# Altium schematic sheet P06.USB.SchDoc
size A4
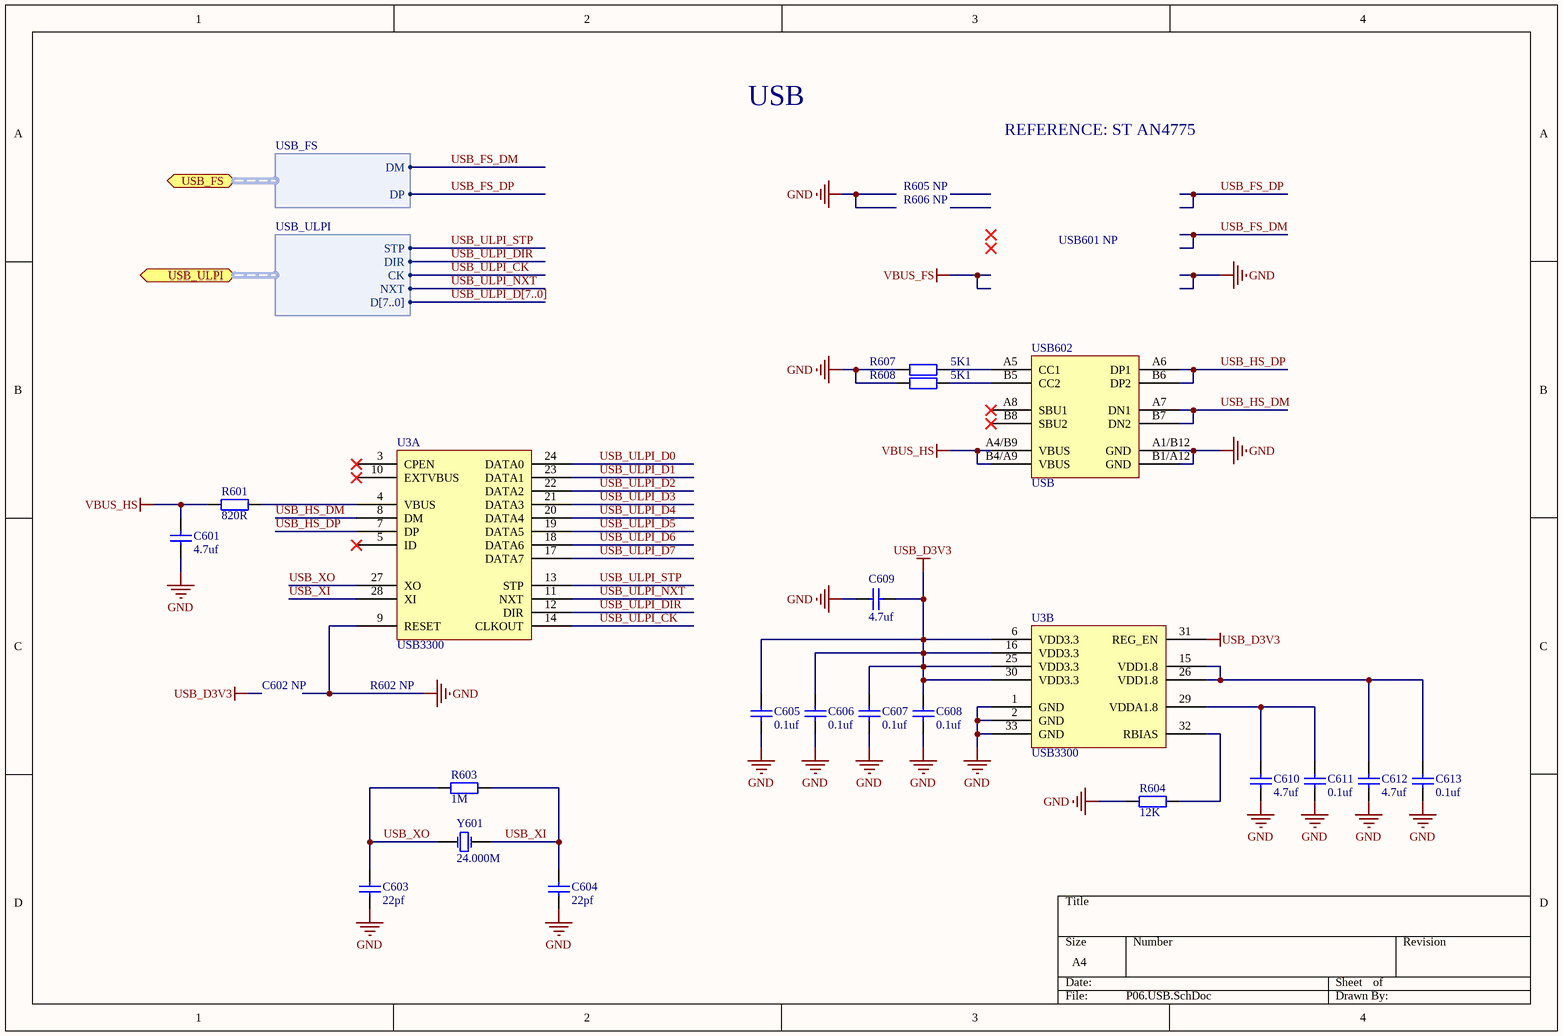
[diagram p0: P06.USB.SchDoc]

## Parts
C601  value 4.7uf  [C0603]  (hidden comment: Cap)
C603  value 22pf  [C0603]  (hidden comment: Cap)
C604  value 22pf  [C0603]  (hidden comment: Cap)
C605  value 0.1uf  [C0402]  (hidden comment: Cap)
C606  value 0.1uf  [C0402]  (hidden comment: Cap)
C607  value 0.1uf  [C0402]  (hidden comment: Cap)
C608  value 0.1uf  [C0402]  (hidden comment: Cap)
C609  value 4.7uf  [C0603]  (hidden comment: Cap)
C610  value 4.7uf  [C0402]  (hidden comment: Cap)
C611  value 0.1uf  [C0402]  (hidden comment: Cap)
C612  value 4.7uf  [C0402]  (hidden comment: Cap)
C613  value 0.1uf  [C0402]  (hidden comment: Cap)
R601  value 820R  [R0603]  (hidden comment: Res)
R603  value 1M  [R0603]  (hidden comment: Res)
R604  value 12K  [R0603]  (hidden comment: Res)
R607  value 5K1  [R0603]  (hidden comment: Res)
R608  value 5K1  [R0603]  (hidden comment: Res)
U3  USB3300  [USB3300-QFN32]  (parts A,B of 2)
USB602  USB  [USB-TYPEC-F-16P-THD]
Y601  value 24.000M  [XTAL-3225]  (hidden comment: XTAL)

## Ports
USB_FS (bidir, harness USB_FS), USB_ULPI (bidir, harness USB_ULPI)

## Harnesses
USB_ULPI: STP, DIR, CK, NXT, D[7..0]
USB_FS: DM, DP

## Nets
GND: C601.1 C603.1 C604.1 C605.1 C606.1 C607.1 C608.1 C609.1 C610.1 C611.1 C612.1 C613.1 R604.1 R607.1 R608.1 U3.1(GND) U3.2(GND) U3.9(RESET) U3.33(GND) USB602.A1/B12(GND) USB602.B1/A12(GND)
USB_D3V3: C605.2 C606.2 C607.2 C608.2 C609.2 U3.6(VDD3.3) U3.16(VDD3.3) U3.25(VDD3.3) U3.30(VDD3.3) U3.31(REG_EN)
VBUS_HS: C601.2 R601.1 USB602.A4/B9(VBUS) USB602.B4/A9(VBUS)
USB_FS_DM: port USB_FS.DM
USB_FS_DP: port USB_FS.DP
USB_HS_DM: U3.8(DM) USB602.A7(DN1) USB602.B7(DN2)
USB_HS_DP: U3.7(DP) USB602.A6(DP1) USB602.B6(DP2)
USB_ULPI_CK: U3.14(CLKOUT) ; port USB_ULPI.CK
USB_ULPI_D0: U3.24(DATA0)
USB_ULPI_D1: U3.23(DATA1)
USB_ULPI_D2: U3.22(DATA2)
USB_ULPI_D3: U3.21(DATA3)
USB_ULPI_D4: U3.20(DATA4)
USB_ULPI_D5: U3.19(DATA5)
USB_ULPI_D6: U3.18(DATA6)
USB_ULPI_D7: U3.17(DATA7)
USB_ULPI_DIR: U3.12(DIR) ; port USB_ULPI.DIR
USB_ULPI_NXT: U3.11(NXT) ; port USB_ULPI.NXT
USB_ULPI_STP: U3.13(STP) ; port USB_ULPI.STP
USB_XI: C604.2 R603.2 U3.28(XI) Y601.3(OSC2)
USB_XO: C603.2 R603.1 U3.27(XO) Y601.1(OSC1)
NetC610_2: C610.2 C611.2 U3.29(VDDA1.8)
NetC612_2: C612.2 C613.2 U3.15(VDD1.8) U3.26(VDD1.8)
NetR601_2: R601.2 U3.4(VBUS)
NetR604_2: R604.2 U3.32(RBIAS)
NetR607_2: R607.2 USB602.A5(CC1)
NetR608_2: R608.2 USB602.B5(CC2)

Not connected (* = marked no-connect by the designer): U3 3(CPEN)* 5(ID)* 10(EXTVBUS)*; USB602 A8(SBU1)* B8(SBU2)*

## Buses and harness runs
bus USB_ULPI_D[7..0]

## Notes on the sheet
- USB
- REFERENCE: ST AN4775
- R605 NP
- R606 NP
- USB601 NP
- C602 NP
- R602 NP

## Library data of the parts
R601 R603 R604 R607 R608 = Res: 电阻
U3 = USB3300: Hi-Speed USB Host, Device or OTG PHY with ULPI Low Pin Interface
USB602 = USB3
Y601 = XTAL3: Crystal Oscillator